# Altium project voltage_reg_project.PrjPcb
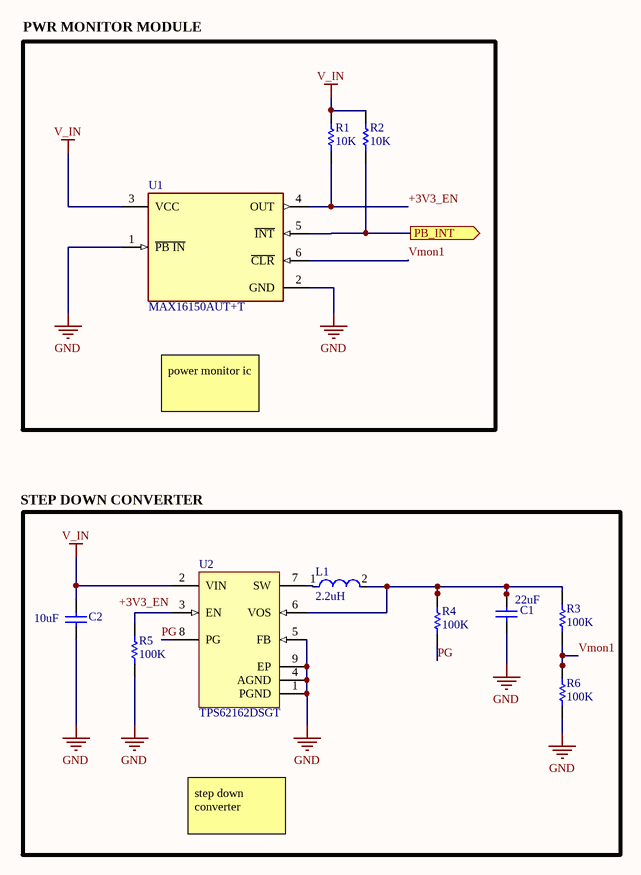
[diagram p0: pwr_regulator.SchDoc]
1 sheet, 11 parts. Net scope: flat (ports and power ports of the same name join across sheets).
Board file: pwr_regulator_pcb.PcbDoc

## Sheet pwr_regulator.SchDoc
size Letter; SheetNumber: 1; SheetTotal: 1

### Parts
C1  22uF  [KEMT-1206-2_M]
C2  10uF  [KEMT-1206-2_M]
L1  2.2uH  [FP-LQH31CN_03-MFG]
R1  10K  [RESC3216X70X50NL05T20]
R2  10K  [RESC3216X70X50NL05T20]
R3  100K  [RESC3216X70X50NL05T20]
R4  100K  [RESC3216X70X50NL05T20]
R5  100K  [RESC3216X70X50NL05T20]
R6  100K  [RESC3216X70X50NL05T20]
U1  MAX16150AUT+T  [FP-U6-1-MFG]
U2  TPS62162DSGT  [DSG0008A_V]

### Blocks framed on the sheet
PWR MONITOR MODULE: R1 R2 U1
STEP DOWN CONVERTER: C1 C2 L1 R3-R6 U2

### Ports
PB_INT (out)

### Nets
GND: C1.1 C2.1 R5.1 R6.1 U1.1(~{PB_IN}) U1.2(GND) U2.1(PGND) U2.4(AGND) U2.5(FB) U2.9(EP)
V_IN: C2.2 R1.2 U1.3(VCC) U2.2(VIN)
+3V3_EN: R1.1 U1.4(OUT)
PG: R4.1 U2.8(PG)
Vmon1: R3.1 R6.2 U1.6(~{CLR})
NetC1_2: C1.2 L1.2 R3.2 R4.2 U2.6(VOS)
NetL1_1: L1.1 U2.7(SW)
NetR2_1: R2.1 U1.5(~{INT}) ; port PB_INT
NetR5_2: R5.2 U2.3(EN)

Not connected (* = marked no-connect by the designer): R2 2

### Notes on the sheet
- power monitor ic
- step down converter
- Labels drawn without touching a wire or pin: +3V3_EN

### Library data of the parts
C1 C2 = CMP-1037-04202-2: CAP, Ceramic, 0.1 uF, +/- 10%, 50 V, -55 to 125 degC, 1206 (3216 Metric), RoHS, Tape and Reel; Manufacturer: Kemet; Voltage Rating: 50V; Capacitance: 0.1µF; Product Range: KEMET-CSeries; SVHC: ToBeAdvised; Dielectric Characteristic: X7R; Capacitor Case Style: 1206[3216Metric]; Package Reference: 1206-2; Package Description: 2-Leads SMD, Body 3.2 x 1.6 mm; Packaging: Tape&Reel; Operating Temperature Max: 125degC; Capacitance Tolerance: ±10%; Datasheet URL: https://datasheet.ciiva.com/6125/1725438-6125494.pdf; Manufacturer URL: http://www.kemet.com/; Operating Temperature Min: -55degC; Datasheet Version: Jul-13
L1 = CMP-06042-002030-1: Wire Wound Ferrite Inductor for General Circuits 56μH ±10% 11.57Ω 50mA 1206; Self Resonant Frequency: 9MHz; Shielding: Unshielded; Test Frequency: 1MHz; DC Resistance (DCR): 8.9R; Inductance: 56uH; Q Factor: 40; Case/Package: 1206; Inductance Tolerance: 10%; Min Operating Temperature: -25°C; DC Current: 50mA; Case Code (Imperial): 1206; Weight: 0.001023oz; Tolerance: 10%; Length: 0.126inch; Mount: Surface Mount; Package Quantity: 2000; Depth: 1.8mm; Max DC Current: 50mA; Packaging: Tape and Reel; Height - Seated (Max): 0.079inch; Core Material: Ferrite; REACH SVHC: No SVHC; Current Rating: 50mA; Case Code (Metric): 3216; Radiation Hardening: No; Resistor Type: Wirewound; Number of Pins: 2; Termination: SMD/SMT; Military Standard: Not; Width: 1.6mm; Height: 0.071inch; Max Operating Temperature: 85°C
R1-R6 = CMP-2003-00541-1: Manufacturer: Panasonic; Part Number: ERJ-8GEY0R00V
U1 = CMP-05723-001129-1: IC SUPERVISOR 1 CHANNEL SOT23-6
U2 = CMP-0323-00319-3: Buck Step Down Regulator with 3 to 17 V Input and 3.3 V Output, -40 to 85 degC, 8-Pin WSON (DSG), Green (RoHS & no Sb/Br); Manufacturer: Texas Instruments; Synchronous Rectification: TRUE; Iq(Typ)(mA): 0.017; Switch Current Limit(Typ)(A): 1.8; Regulated Outputs(#): 1; Duty Cycle(Max)(%): 100; SubFamily: Step-Down Regulator; Preset Vout(V): 3.3; Rating: Catalog; Vin(Max)(V): 17; Vin(Min)(V): 3; ComponentLink2Description: Package Specification; PackageVersion: revB, Oct-2010; DatasheetVersion: SLVSAM2A; ComponentLink1Description: Datasheet; PackageDescription: 8-Pin Plastic Small Outline No-Lead, 2 x 2 x 0.8 mm Body, 0.5 mm Pitch, Exposed Pad; ComponentLink2URL: http://www.ti.com/litv/pdf/mpds308a; Code_JEDEC: MO-229; PartNumber: TPS62162DSGT; ComponentLink3URL: Samples URL:http://www.ti.com/product/tps54611#samples; Mounting Technology: Surface Mount; Eco-Plan: Green (RoHS & no Sb/Br); Vout(Min)(V): 3.3; PackageReference: DSG0008A; Topology: Buck; ComponentLink1URL: http://www.ti.com/general/docs/lit/getliterature.tsp?genericPartNumber=TPS62162&fileType=pdf; Vout(Max)(V): 3.3; Iout(Max)(A): 1; ComponentLink3Description: URL Link1